# EasyEDA Pro project 电源板48-24.eprj, board PCB
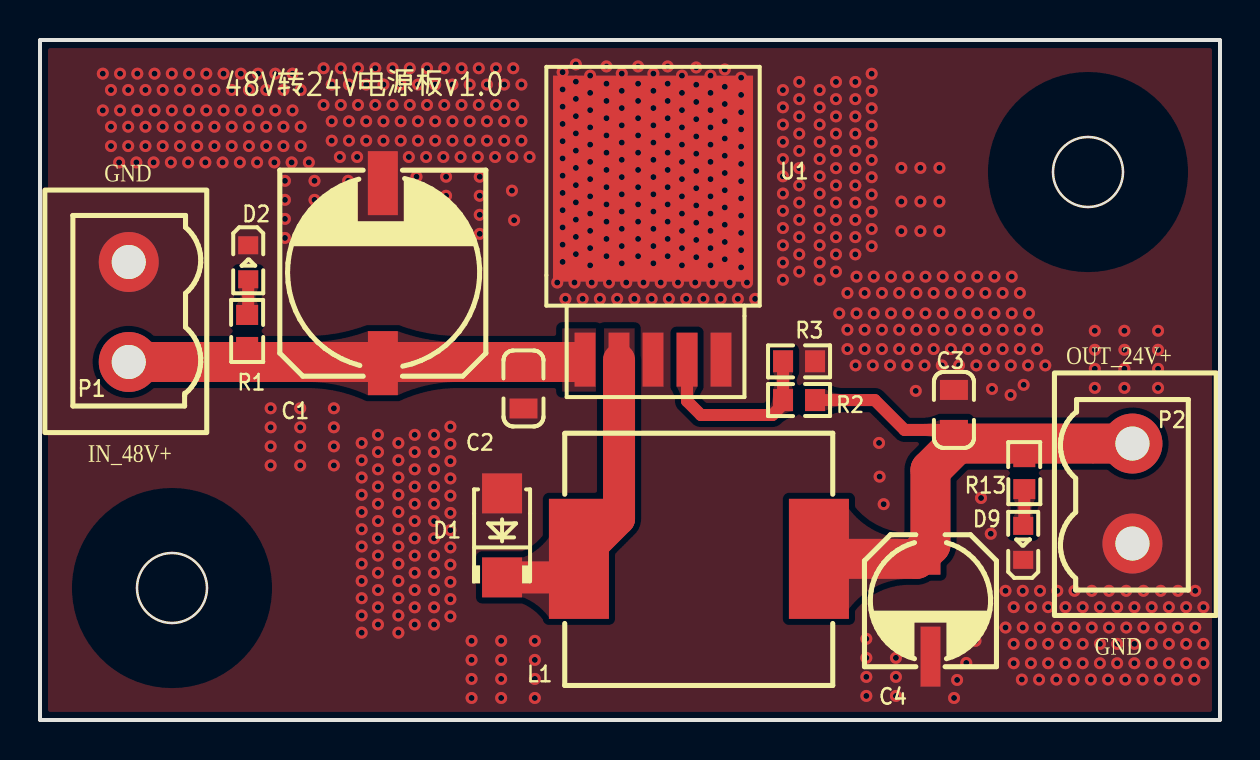
[diagram p1: board, top side]
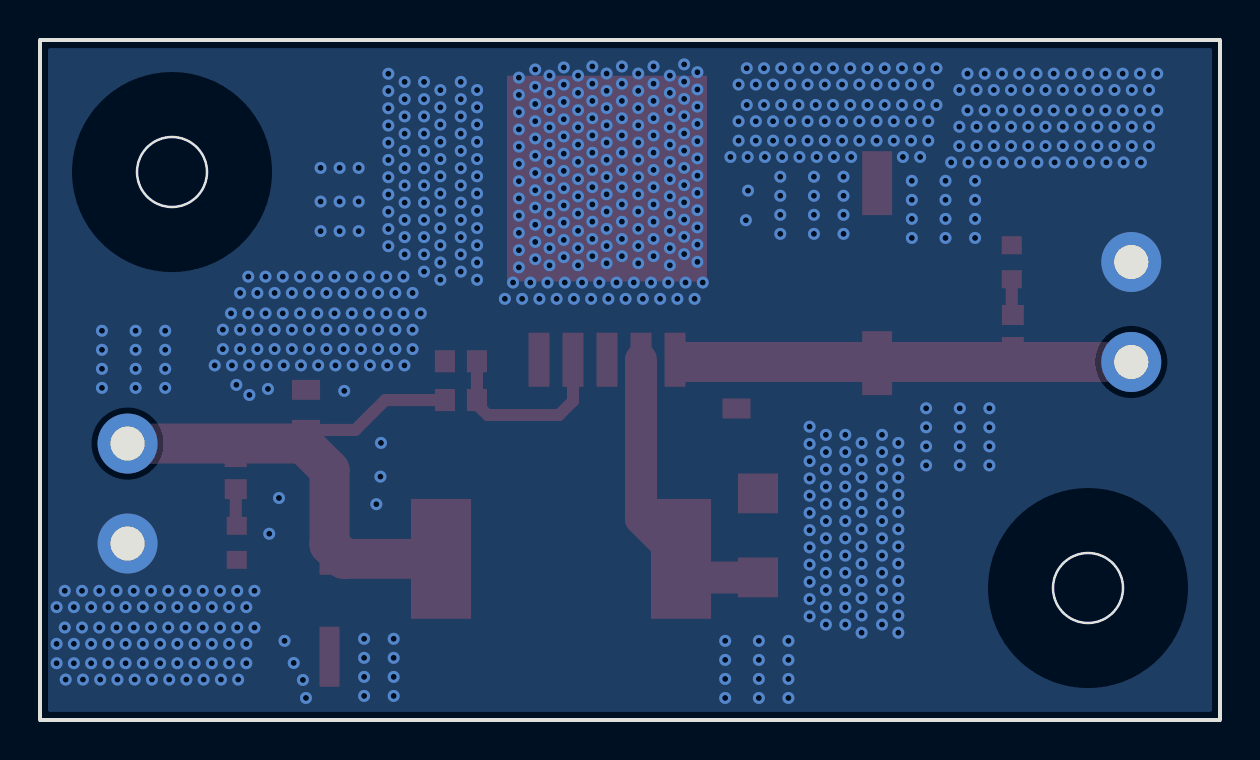
[diagram p2: board, bottom side, seen from below]

Outline 59 x 34 mm; copper layers: Top Layer, Bottom Layer. Coordinates in mm from the lower left corner of the outline.
Outline path: rectangle 0,34 59,0 ; circle c6.6,6.6 r1.75 ; circle c52.4,27.4 r1.75
Stack: Top Layer 0.035mm / Dielectric1 1.51mm FR4 er 4.5 / Bottom Layer 0.035mm

## Design rules (mm)
template: 用户自定义配置
spacing Default (default): track to track 0.152, other pairs 0 to 0.152
track width Default (default): min 0.254, default 0.254, max 25.4
differential pair differentialPair (default): width min 0.127, default 0.254, max 2.54; gap min 0.152, default 0.152
via Default (default): diameter min 0.25, default 0.61, max 100.025; hole min 0.2, default 0.305, max 59.995

## Placement (name value [footprint] x y rotation side)
C1  100uF/63V  [电解电容贴片10x10]  17.24 22.08 90 top
C2  104  [0805C]  24.17 16.58 90 top
C3  104  [0805C]  45.7 15.5 270 top
C4  100uF/35V  [电解电容贴片6X6]  44.52 5.97 270 top
D1  SS56  [SMA]  23.1 9.23 90 top
D2  红光  [0603LED]  10.39 22.92 90 top
D9  红光  [0603LED]  49.18 8.82 270 top
L1  47uH/5A  [IND-SMD_L13.45-W12.6]  32.95 8.06 0 top
P1  5.08-2P  [CONN-TH_WJ2EDGVC-5.08-2P]  4.44 20.4 90 top
P2  5.08-2P  [CONN-TH_WJ2EDGVC-5.08-2P]  54.62 11.32 270 top
R1  10K  [0603R]  10.36 19.45 270 top
R2  47K  [0603R]  37.95 16 0 top
R3  2.4K  [0603R]  37.95 17.93 180 top
R13  10K  [0603R]  49.22 12.34 90 top
U1  LM2576HVS-ADJ  [TO-263]  30.65 22.54 0 top

## Footprints (pads in the part's own frame, mm; a bottom-side part is the same pattern mirrored in y, then rotated)
0603LED
  rect 0.9x1 smd: 1(-0.884,-0.017) 2(0.816,-0.017)
0603R
  rect 1x1.1 smd: 1(-0.8,0) 2(0.8,0)
0805C
  rect 1x1.4 smd: 1(-1,0) 2(1,0)
CONN-TH_WJ2EDGVC-5.08-2P
  round 3 hole 1.7: 1(-2.499,0) 2(2.499,0)
IND-SMD_L13.45-W12.6
  rect 3x6 smd: 1(-6,0) 2(6,0)
SMA
  rect 2x2 smd: 1(2.1,0) 2(-2.1,0)
TO-263
  rect 1.05x2.7 smd: 1(-3.4,-4.526) 2(-1.7,-4.526) 3(0,-4.526) 4(1.7,-4.526) 5(3.4,-4.526)
  rect 10x10.3 smd: 3(0,4.526)
电解电容贴片6X6
  rect 3x1 smd: 1(-2.8,0) 2(2.8,0)
电解电容贴片10x10
  rect 3.2x1.5 smd: 1(-4.242,0.097) 2(4.758,0.097)

## Nets
As in the schematic.

## Via types
v1: diameter 0.6, hole 0.3, Top Layer to Bottom Layer, 696 vias

## Routing (per net, layer and track width the routed paths; a pad name or vN(x,y) marks a point on that pad's centre or on a via; arc(x,y) is an arc through that point)
24V_1: length 27.8
  Top Layer w0.6: C3.2 43.23,14.5 41.74,16 R2.2
  Top Layer w2: L1.2 43.81,8.06 C4.1 44.52,12.5 45.85,13.82 P2.1
48V_IN: length 22.2
  Top Layer w2: 26.67,17.9 P1.1
GND:
  vias: v1(3.14,32.32) v1(3.14,30.48) v1(3.55,31.5) v1(3.55,29.66) v1(3.55,28.7) v1(4,32.32) v1(4,30.48) v1(3.96,27.88) v1(4.41,31.5) v1(4.41,29.66) v1(4.41,28.7) v1(4.82,27.88) v1(4.87,32.32) v1(4.87,30.48) v1(5.27,31.5) v1(5.27,29.66) v1(5.27,28.7) v1(5.68,27.88) v1(5.73,32.32) v1(5.73,30.48) v1(6.14,31.5) v1(6.14,29.66) v1(6.14,28.7) v1(6.59,32.32) v1(6.59,30.48) v1(6.54,27.88) v1(7,31.5) v1(7,29.66) v1(7,28.7) v1(7.41,27.88) v1(7.45,32.32) v1(7.45,30.48) v1(7.86,31.5) v1(7.86,29.66) v1(7.86,28.7) v1(8.31,32.32) v1(8.31,30.48) v1(8.27,27.88) v1(8.72,31.5) v1(8.72,29.66) v1(8.72,28.7) v1(9.18,32.32) v1(9.18,30.48) v1(9.13,27.88) v1(9.59,31.5) v1(9.59,29.66) v1(9.59,28.7) v1(9.99,27.88) v1(10.04,32.32) v1(10.04,30.48) v1(10.45,31.5) v1(10.45,29.66) v1(10.45,28.7) v1(10.9,32.32) v1(10.9,30.48) v1(10.86,27.88) v1(11.31,31.5) v1(11.31,29.66) v1(11.31,28.7) v1(11.53,15.59) v1(11.53,14.63) v1(11.53,13.68) v1(11.53,12.73) v1(11.72,27.88) v1(11.76,32.32) v1(11.76,30.48) v1(12.17,31.5) v1(12.17,29.66) v1(12.17,28.7) v1(12.25,26.96) v1(12.25,26.01) v1(12.25,25.05) v1(12.25,24.1) v1(12.58,27.88) v1(12.63,32.32) v1(12.63,30.48) v1(13.01,15.59) v1(13.01,14.63) v1(13.01,13.68) v1(13.01,12.73) v1(13.03,31.5) v1(13.03,29.66) v1(13.03,28.7) v1(13.44,27.88) v1(13.73,26.96) v1(13.73,26.01) v1(13.73,25.05) v1(13.73,24.1) v1(14.18,32.59) v1(14.18,30.75) v1(14.59,31.77) v1(14.59,29.94) v1(14.59,28.97) v1(14.69,15.59) v1(14.69,14.63) v1(14.69,13.68) v1(14.69,12.73) v1(14.99,28.15) v1(15.04,32.59) v1(15.04,30.75) v1(15.41,26.96) v1(15.41,26.01) v1(15.41,25.05) v1(15.41,24.1) v1(15.45,31.77) v1(15.45,29.94) v1(15.45,28.97) v1(15.9,32.59) v1(15.9,30.75) v1(15.86,28.15) v1(16.08,13.85) v1(16.08,12.99) v1(16.08,12.13) v1(16.08,11.26) v1(16.08,10.4) v1(16.08,9.54) v1(16.08,8.68) v1(16.08,7.81) v1(16.08,6.95) v1(16.08,6.09) v1(16.08,5.23) v1(16.08,4.36) v1(16.31,31.77) v1(16.31,29.94) v1(16.31,28.97) v1(16.76,32.59) v1(16.76,30.75) v1(16.9,14.26) v1(16.9,13.4) v1(16.9,12.53) v1(16.9,11.67) v1(16.9,10.81) v1(16.9,9.95) v1(16.9,9.08) v1(16.9,8.22) v1(16.9,7.36) v1(16.9,6.5) v1(16.9,5.63) v1(16.9,4.77) v1(17.17,31.77) v1(17.17,29.94) v1(17.17,28.97) v1(17.63,32.59) v1(17.63,30.75) v1(17.92,13.85) v1(17.92,12.99) v1(17.92,12.13) v1(17.92,11.26) v1(17.92,10.4) v1(17.92,9.54) v1(17.92,8.68) v1(17.92,7.81) v1(17.92,6.95) v1(17.92,6.09) v1(17.92,5.23) v1(17.92,4.36) v1(18.04,31.77) v1(18.04,29.94) v1(18.04,28.97) v1(18.49,32.59) v1(18.49,30.75) v1(18.44,28.15) v1(18.74,14.26) v1(18.74,13.4) v1(18.74,12.53) v1(18.74,11.67) v1(18.74,10.81) v1(18.74,9.95) v1(18.74,9.08) v1(18.74,8.22) v1(18.74,7.36) v1(18.74,6.5) v1(18.74,5.63) v1(18.74,4.77) v1(18.9,31.77) v1(18.9,29.94) v1(18.9,28.97) v1(18.83,27.16) v1(18.83,26.21) v1(18.83,25.26) v1(18.83,24.31) v1(19.31,28.15) v1(19.35,32.59) v1(19.35,30.75) v1(19.7,14.26) v1(19.7,13.4) v1(19.7,12.53) v1(19.7,11.67) v1(19.7,10.81) v1(19.7,9.95) v1(19.7,9.08) v1(19.7,8.22) v1(19.7,7.36) v1(19.7,6.5) v1(19.7,5.63) v1(19.7,4.77) v1(19.76,31.77) v1(19.76,29.94) v1(19.76,28.97) v1(20.21,32.59) v1(20.21,30.75) v1(20.17,28.15) v1(20.3,27.16) v1(20.3,26.21) v1(20.3,25.26) v1(20.3,24.31) v1(20.52,14.67) v1(20.52,13.8) v1(20.52,12.94) v1(20.52,12.08) v1(20.52,11.22) v1(20.52,10.35) v1(20.52,9.49) v1(20.52,8.63) v1(20.52,7.77) v1(20.52,6.9) v1(20.52,6.04) v1(20.52,5.18) v1(20.62,31.77) v1(20.62,29.94) v1(20.62,28.97) v1(21.08,32.59) v1(21.08,30.75) v1(21.03,28.15) v1(21.48,31.77) v1(21.48,29.94) v1(21.48,28.97) v1(21.58,3.96) v1(21.58,3.01) v1(21.58,2.05) v1(21.58,1.1) v1(21.89,28.15) v1(21.94,32.59) v1(21.94,30.75) v1(21.99,27.16) v1(21.99,26.21) v1(21.99,25.26) v1(21.99,24.31) v1(22.35,31.77) v1(22.35,29.94) v1(22.35,28.97) v1(22.8,32.59) v1(22.8,30.75) v1(22.76,28.15) v1(23.06,3.96) v1(23.06,3.01) v1(23.06,2.05) v1(23.06,1.1) v1(23.21,31.77) v1(23.21,29.94) v1(23.21,28.97) v1(23.62,28.15) v1(23.6,26.47) v1(23.66,32.59) v1(23.66,30.75) v1(23.71,24.99) v1(24.07,31.77) v1(24.07,29.94) v1(24.07,28.97) v1(24.48,28.15) v1(24.74,3.96) v1(24.74,3.01) v1(24.74,2.05) v1(24.74,1.1) v1(25.86,21.87) v1(26.13,32.39) v1(26.13,31.53) v1(26.13,30.67) v1(26.13,29.8) v1(26.13,28.94) v1(26.13,28.08) v1(26.13,27.22) v1(26.13,26.35) v1(26.13,25.49) v1(26.13,24.63) v1(26.13,23.77) v1(26.13,22.9) v1(26.27,21.06) v1(26.79,32.78) v1(26.79,31.92) v1(26.79,31.05) v1(26.79,30.19) v1(26.79,29.33) v1(26.79,28.47) v1(26.79,27.61) v1(26.79,26.74) v1(26.79,25.88) v1(26.79,25.02) v1(26.79,24.16) v1(26.79,23.29) v1(26.72,21.87) v1(27.13,21.06) v1(27.51,32.22) v1(27.51,31.36) v1(27.51,30.49) v1(27.51,29.63) v1(27.51,28.77) v1(27.51,27.91) v1(27.51,27.04) v1(27.51,26.18) v1(27.51,25.32) v1(27.51,24.46) v1(27.51,23.59) v1(27.51,22.73) v1(27.59,21.87) v1(28,21.06) v1(28.32,32.68) v1(28.32,31.82) v1(28.32,30.95) v1(28.32,30.09) v1(28.32,29.23) v1(28.32,28.37) v1(28.32,27.5) v1(28.32,26.64) v1(28.32,25.78) v1(28.32,24.92) v1(28.32,24.05) v1(28.32,23.19) v1(28.45,21.87) v1(28.86,21.06) v1(29.09,32.32) v1(29.09,31.46) v1(29.09,30.6) v1(29.09,29.73) v1(29.09,28.87) v1(29.09,28.01) v1(29.09,27.15) v1(29.09,26.28) v1(29.09,25.42) v1(29.09,24.56) v1(29.09,23.7) v1(29.09,22.83) v1(29.31,21.87) v1(29.72,21.06) v1(29.9,32.68) v1(29.9,31.82) v1(29.9,30.95) v1(29.9,30.09) v1(29.9,29.23) v1(29.9,28.37) v1(29.9,27.5) v1(29.9,26.64) v1(29.9,25.78) v1(29.9,24.92) v1(29.9,24.05) v1(29.9,23.19) v1(30.17,21.87) v1(30.58,21.06) v1(30.67,32.32) v1(30.67,31.46) v1(30.67,30.6) v1(30.67,29.73) v1(30.67,28.87) v1(30.67,28.01) v1(30.67,27.15) v1(30.67,26.28) v1(30.67,25.42) v1(30.67,24.56) v1(30.67,23.7) v1(30.67,22.83) v1(31.04,21.87) v1(31.38,32.68) v1(31.38,31.82) v1(31.38,30.95) v1(31.38,30.09) v1(31.38,29.23) v1(31.38,28.37) v1(31.38,27.5) v1(31.38,26.64) v1(31.38,25.78) v1(31.38,24.92) v1(31.38,24.05) v1(31.38,23.19) v1(31.44,21.06) v1(31.9,21.87) v1(32.1,32.22) v1(32.1,31.36) v1(32.1,30.49) v1(32.1,29.63) v1(32.1,28.77) v1(32.1,27.91) v1(32.1,27.04) v1(32.1,26.18) v1(32.1,25.32) v1(32.1,24.46) v1(32.1,23.59) v1(32.1,22.73) v1(32.31,21.06) v1(32.81,32.63) v1(32.81,31.76) v1(32.81,30.9) v1(32.81,30.04) v1(32.81,29.18) v1(32.81,28.31) v1(32.81,27.45) v1(32.81,26.59) v1(32.81,25.73) v1(32.81,24.87) v1(32.81,24) v1(32.81,23.14) v1(32.76,21.87) v1(33.17,21.06) v1(33.53,32.22) v1(33.53,31.36) v1(33.53,30.49) v1(33.53,29.63) v1(33.53,28.77) v1(33.53,27.91) v1(33.53,27.04) v1(33.53,26.18) v1(33.53,25.32) v1(33.53,24.46) v1(33.53,23.59) v1(33.53,22.73) v1(33.62,21.87) v1(34.03,21.06) v1(34.24,32.52) v1(34.24,31.66) v1(34.24,30.8) v1(34.24,29.94) v1(34.24,29.08) v1(34.24,28.21) v1(34.24,27.35) v1(34.24,26.49) v1(34.24,25.63) v1(34.24,24.76) v1(34.24,23.9) v1(34.24,23.04) v1(34.49,21.87) v1(34.89,21.06) v1(35.06,32.12) v1(35.06,31.25) v1(35.06,30.39) v1(35.06,29.53) v1(35.06,28.67) v1(35.06,27.8) v1(35.06,26.94) v1(35.06,26.08) v1(35.06,25.22) v1(35.06,24.36) v1(35.06,23.49) v1(35.06,22.63) v1(35.35,21.87) v1(35.76,21.06) v1(37.15,31.5) v1(37.15,30.63) v1(37.15,29.77) v1(37.15,28.91) v1(37.15,28.05) v1(37.15,27.18) v1(37.15,26.32) v1(37.15,25.46) v1(37.15,24.6) v1(37.15,23.74) v1(37.15,22.87) v1(37.15,22.01) v1(37.96,31.9) v1(37.96,31.04) v1(37.96,30.18) v1(37.96,29.32) v1(37.96,28.45) v1(37.96,27.59) v1(37.96,26.73) v1(37.96,25.87) v1(37.96,25.01) v1(37.96,24.14) v1(37.96,23.28) v1(37.96,22.42) v1(38.98,31.5) v1(38.98,30.63) v1(38.98,29.77) v1(38.98,28.91) v1(38.98,28.05) v1(38.98,27.18) v1(38.98,26.32) v1(38.98,25.46) v1(38.98,24.6) v1(38.98,23.74) v1(38.98,22.87) v1(38.98,22.01) v1(39.8,31.9) v1(39.8,31.04) v1(39.8,30.18) v1(39.8,29.32) v1(39.8,28.45) v1(39.8,27.59) v1(39.8,26.73) v1(39.8,25.87) v1(39.8,25.01) v1(39.8,24.14) v1(39.8,23.28) v1(39.8,22.42) v1(39.96,20.33) v1(40.37,21.35) v1(40.37,19.52) v1(40.37,18.55) v1(40.77,31.9) v1(40.77,31.04) v1(40.77,30.18) v1(40.77,29.32) v1(40.77,28.45) v1(40.77,27.59) v1(40.77,26.73) v1(40.77,25.87) v1(40.77,25.01) v1(40.77,24.14) v1(40.77,23.28) v1(40.78,17.73) v1(40.83,22.17) v1(40.83,20.33) v1(41.23,21.35) v1(41.23,19.52) v1(41.23,18.55) v1(41.32,4.06) v1(41.32,3.11) v1(41.32,2.16) v1(41.32,1.2) v1(41.58,32.31) v1(41.58,31.45) v1(41.58,30.59) v1(41.58,29.73) v1(41.58,28.86) v1(41.58,28) v1(41.58,27.14) v1(41.58,26.28) v1(41.58,25.41) v1(41.58,24.55) v1(41.58,23.69) v1(41.69,22.17) v1(41.69,20.33) v1(41.64,17.73) v1(41.95,13.85) v1(41.98,12.17) v1(42.1,21.35) v1(42.1,19.52) v1(42.1,18.55) v1(42.18,10.79) v1(42.5,17.73) v1(42.55,22.17) v1(42.55,20.33) v1(42.8,4.06) v1(42.8,3.11) v1(42.8,2.16) v1(42.8,1.2) v1(42.96,21.35) v1(42.96,19.52) v1(42.96,18.55) v1(43.07,27.6) v1(43.07,25.92) v1(43.07,24.44) v1(43.41,22.17) v1(43.41,20.33) v1(43.37,17.73) v1(43.82,21.35) v1(43.82,19.52) v1(43.82,18.55) v1(43.79,16.46) v1(44.02,27.6) v1(44.02,25.92) v1(44.02,24.44) v1(44.27,22.17) v1(44.27,20.33) v1(44.23,17.73) v1(44.68,21.35) v1(44.68,19.52) v1(44.68,18.55) v1(44.97,27.6) v1(44.97,25.92) v1(44.97,24.44) v1(45.09,17.73) v1(45.14,22.17) v1(45.14,20.33) v1(45.55,21.35) v1(45.55,19.52) v1(45.55,18.55) v1(45.7,1.1) v1(45.86,2) v1(46,22.17) v1(46,20.33) v1(45.95,17.73) v1(46.31,2.85) v1(46.41,21.35) v1(46.41,19.52) v1(46.41,18.55) v1(46.82,17.73) v1(46.77,3.96) v1(46.86,22.17) v1(46.86,20.33) v1(47.05,11.1) v1(47.27,21.35) v1(47.27,19.52) v1(47.27,18.55) v1(47.6,16.55) v1(47.54,9.31) v1(47.68,17.73) v1(47.72,22.17) v1(47.72,20.33) v1(48.13,21.35) v1(48.13,19.52) v1(48.13,18.55) v1(48.28,6.46) v1(48.28,4.62) v1(48.59,22.17) v1(48.59,20.33) v1(48.54,17.73) v1(48.53,16.25) v1(48.68,5.64) v1(48.68,3.81) v1(48.68,2.84) v1(48.99,21.35) v1(48.99,19.52) v1(48.99,18.55) v1(49.09,2.02) v1(49.18,16.76) v1(49.14,6.46) v1(49.14,4.62) v1(49.4,17.73) v1(49.45,20.33) v1(49.55,5.64) v1(49.55,3.81) v1(49.55,2.84) v1(49.86,19.52) v1(49.86,18.55) v1(50,6.46) v1(50,4.62) v1(49.95,2.02) v1(50.27,17.73) v1(50.41,5.64) v1(50.41,3.81) v1(50.41,2.84) v1(50.82,2.02) v1(50.86,6.46) v1(50.86,4.62) v1(51.27,5.64) v1(51.27,3.81) v1(51.27,2.84) v1(51.68,2.02) v1(51.73,6.46) v1(51.73,4.62) v1(52.13,5.64) v1(52.13,3.81) v1(52.13,2.84) v1(52.59,6.46) v1(52.59,4.62) v1(52.54,2.02) v1(52.74,19.46) v1(52.74,18.51) v1(52.74,17.56) v1(52.74,16.61) v1(53,5.64) v1(53,3.81) v1(53,2.84) v1(53.4,2.02) v1(53.45,6.46) v1(53.45,4.62) v1(53.86,5.64) v1(53.86,3.81) v1(53.86,2.84) v1(54.22,19.46) v1(54.22,18.51) v1(54.22,17.56) v1(54.22,16.61) v1(54.31,6.46) v1(54.31,4.62) v1(54.27,2.02) v1(54.72,5.64) v1(54.72,3.81) v1(54.72,2.84) v1(55.17,6.46) v1(55.17,4.62) v1(55.13,2.02) v1(55.58,5.64) v1(55.58,3.81) v1(55.58,2.84) v1(55.9,19.46) v1(55.9,18.51) v1(55.9,17.56) v1(55.9,16.61) v1(55.99,2.02) v1(56.04,6.46) v1(56.04,4.62) v1(56.45,5.64) v1(56.45,3.81) v1(56.45,2.84) v1(56.9,6.46) v1(56.9,4.62) v1(56.85,2.02) v1(57.31,5.64) v1(57.31,3.81) v1(57.31,2.84) v1(57.72,2.02) v1(57.76,6.46) v1(57.76,4.62) v1(58.17,5.64) v1(58.17,3.81) v1(58.17,2.84)
$1N74180: length 15
  Top Layer w1.6: D1.2 26.02,7.13 L1.1 28.95,10.06 U1.2
$1N74181: length 9.5
  Top Layer w0.6: R3.2 R2.1 37.15,15.78 36.62,15.25 33.05,15.25 32.35,15.95 U1.4
$1N74206: length 1.8
  Top Layer w0.6: R1.1 10.41,20.31 D2.1
$1N76111: length 1.9
  Top Layer w0.6: R13.1 49.22,9.76 D9.1

## Copper pours and planes (outline as drawn; the poured copper is in the pictures)
48V_IN on Top Layer: 26.11,19.58 27.8,19.58 27.8,16.42 26.11,16.42
GND on Top Layer: -1.53,35.7 61.15,35.7 61.15,-1.48 -1.53,-1.48
GND on Bottom Layer: -1.48,35.34 60.28,35.34 60.28,-1.17 -1.48,-1.17
$1N74180 on Top Layer: 28.2,19.58 29.73,19.58 29.73,16.42 28.2,16.42

Small or netless copper shapes (teardrops, artwork), in the pictures only: 17 on Top Layer

## Text on the board
Top Silkscreen Layer: IN_48V+ | GND | OUT_24V+ | 48V转24V电源板v1.0
